# EAGLE design Amplifier (EAGLE 7.4.0)
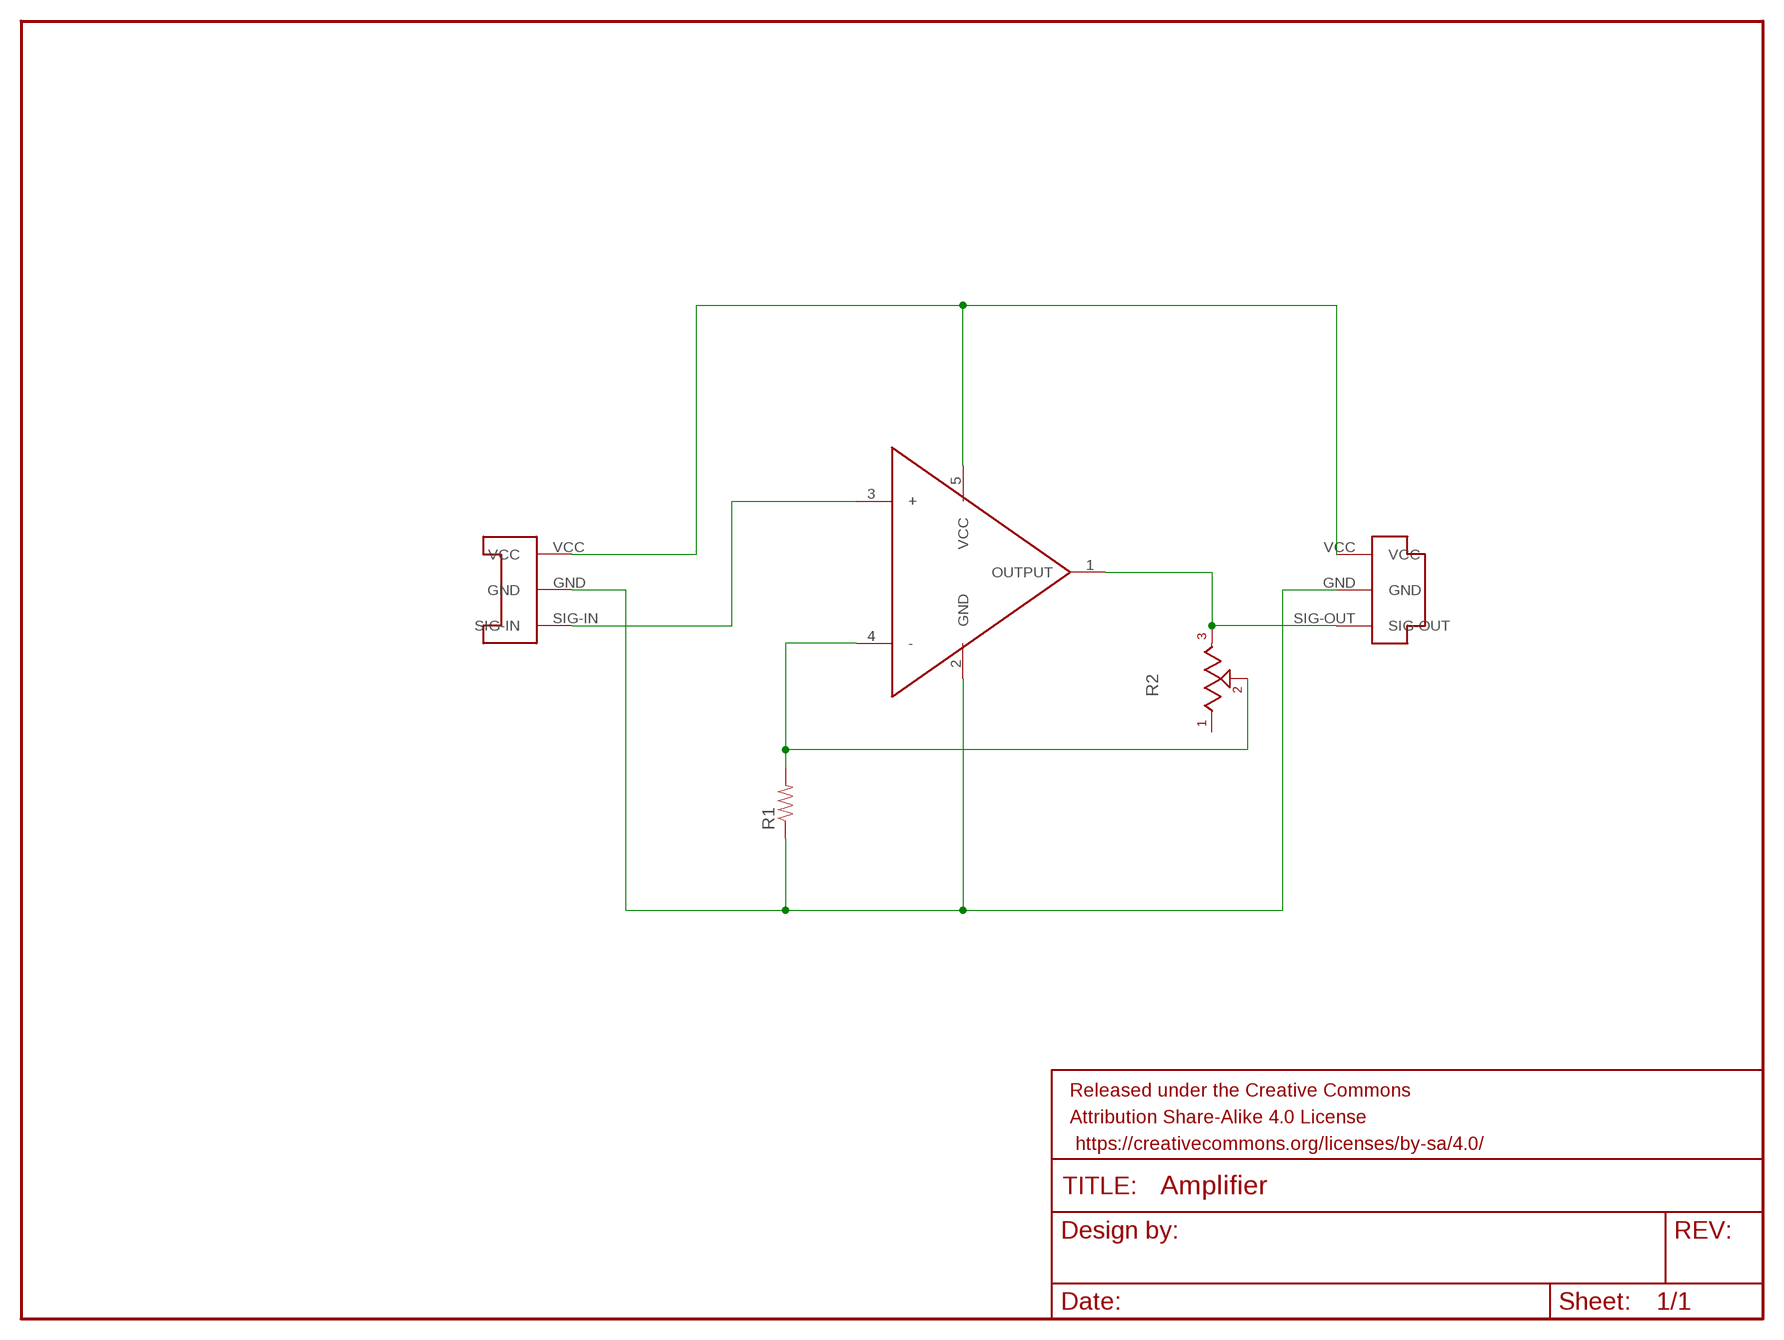
[diagram p0: schematic, sheet 1]

## Parts
FRAME1  FRAME-LETTERNO_PACKAGE  [DUMMY]
R1  RESISTOR0603  [0603-RES]
R2  POT-TRIM-SMD-BOURNS-3314J-1  [POT-TRIM-SMD-BOURNS-3314]
U$1  CONN-PLUG-3POS-3MM  [PLUG-3POS-3MM-SMD]
U$2  CONN-SOCKET-3POS-3MM  [SOCKET-3POS-3MM-SMD]
U$3  OPAMP-MCP6001SC70-5  [SC70]

## Nets
GND: R1.1 U$1.GND U$2.GND U$3.2(GND)
N$2: U$2.SIG-IN U$3.3(+)
N$5: R1.2 R2.2 U$3.4(-)
N$6: R2.1 U$1.SIG-OUT U$3.1(OUTPUT)
VCC: U$1.VCC U$2.VCC U$3.5(VCC)
Unconnected: R2.3

## Library data of the parts
FRAME1 = SparkFun-Aesthetics:FRAME-LETTER: Schematic Frame Standard 8.5x11 US Letter frame; DESIGNER: Nobody; VERSION: v01
R1 = SparkFun-Resistors:RESISTOR: Resistor Basic schematic elements and footprints for 0603, 1206, and PTH resistors.
R2 = LITTLEBITS140915:POT-TRIM-SMD-BOURNS-3314: Bourns 3314 - 4mm Square Trimming Potentiometer
U$1 = EmbeddedPlayground:CONN-PLUG-3POS-3MM: Surface mount board to board connector. Female socket, 3 position.
U$2 = EmbeddedPlayground:CONN-SOCKET-3POS-3MM: Surface mount board to board connector. Female socket, 3 position.
U$3 = EmbeddedPlayground:OPAMP-MCP6001

## Board
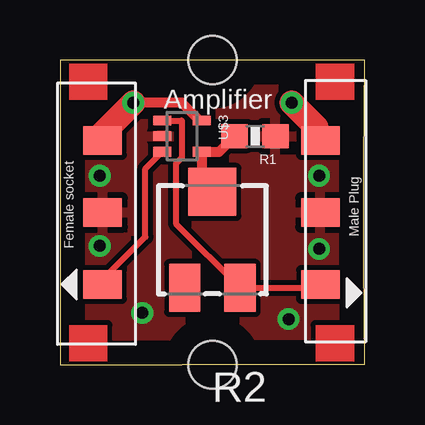
[diagram p1: board, top side]
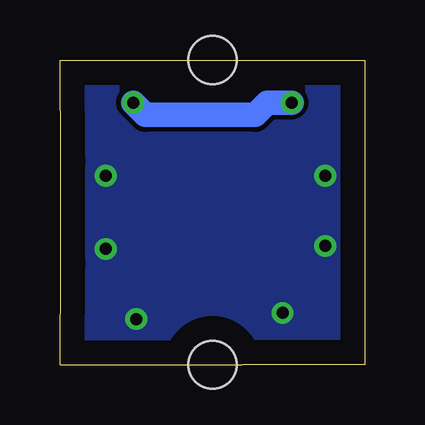
[diagram p2: board, bottom side, seen from below]

Size 12.7 x 12.7 mm. Coordinates in mm from the lower left corner, seen from the top.
Outline: 5.08,0 0,0 0,12.7 5.08,12.7
Outline: 5.1,12.7 12.7,12.7 arc2 12.7,0 5.1,0
Copper layers (1*16): Top 0.035mm / dielectric 1.5mm / Bottom 0.035mm
Design rules "default": minimum track width 10mil, minimum drill 24mil, track to track 8mil, track to pad 8mil, pad to pad 8mil, via to via 8mil, smd to smd 8mil, copper to edge 40mil, drill to drill 8mil, minimum pad ring 10mil, minimum via ring 8mil, stop-mask expansion 4mil, vias tented up to drill 0mil, thermal gap 10mil
Holes 2 mm at 6.35,12.7 6.35,0

### Footprints (pad centres in the part's own frame; a part is rotated, then mirrored left to right if it is on the bottom)
0603-RES = smd 1.1 x 1: 1 -0.85,0; 2 0.85,0
POT-TRIM-SMD-BOURNS-3314 = smd 1.3 x 2: 1 -1.15,2; 3 1.15,2 | smd 2 x 2: 2 0,-2
PLUG-3POS-3MM-SMD = smd 1.2 x 1.6: GND 0,0; SIG-OUT 3,0; VCC -3,0
SOCKET-3POS-3MM-SMD = smd 1.2 x 1.6: GND 0,0; SIG-IN -3,0; VCC 3,0
SC70 = smd 0.4 x 0.75: 1 -0.65,-0.825; 2 0,-0.825; 3 0.65,-0.825; 4 0.65,0.825; 5 -0.65,0.825

### Placement (x,y rotation side)
FRAME1  0,0 0 top
R1  8.13,9.53 180 top
R2  6.35,5.21 180 top
U$1  10.85,6.35 270 top
U$2  1.78,6.35 90 top
U$3  5.08,9.53 270 top

### Tracks (layer width: path | path; a pad name or v marks a point on that pad's centre or on a via)
GND  (via drill 0.5)
  other vias: 1.65,7.87 10.79,7.87 1.65,4.95 10.79,4.83 3.43,2.16 9.53,1.91
  pour Top: -2.54,15.24 -2.54,-2.54 15.24,-2.54 15.24,15.24
  pour Bottom: -2.54,15.24 15.24,15.24 15.24,-2.54 -2.54,-2.54
N$2
  Top 0.254: U$2.SIG-IN 1.78,3.56 3.56,5.33 3.56,8.18 U$3.3
N$4  (via drill 0.5)
  other vias: 3.05,10.92
N$5
  Top 0.406: R1.2 6.63,8.88 U$3.4 5.91,7.4 R2.2
N$6
  Top 0.254: U$1.SIG-OUT 10.71,3.21 R2.1 4.83,5.88 4.83,8.38 5.08,8.64 5.08,10.16 5.07,10.18 U$3.1
N$7  (via drill 0.5)
  other vias: 9.65,10.92
VCC  (via drill 0.5)
  Top 0.406: U$3.5 5.83,10.18 5.08,10.92 v3.05,10.92
  Top 1.016: U$2.VCC 1.78,9.65 v3.05,10.92 | v9.65,10.92 10.67,9.91 10.67,9.53 U$1.VCC
  Bottom 1.016: v3.05,10.92 4.06,10.92 4.57,10.41 9.14,10.41 v9.65,10.92

### Text on the board
tPlace: Amplifier